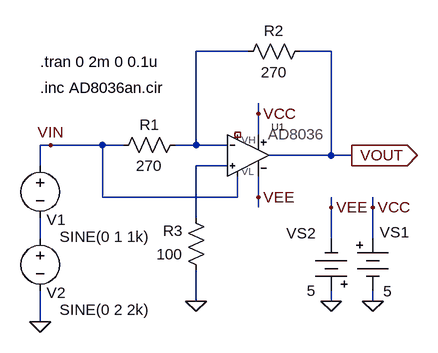
[diagram p0: schematic fig-01-03-15.asc]
fig-01-03-15.asc, the LTspice schematic file:
Version 4
SHEET 1 880 680
WIRE 192 16 112 16
WIRE 320 16 272 16
WIRE 208 112 208 96
WIRE 208 144 208 112
WIRE -112 160 -128 160
WIRE -32 160 -112 160
WIRE 0 160 -32 160
WIRE 112 160 112 16
WIRE 112 160 80 160
WIRE 160 160 112 160
WIRE 320 176 320 16
WIRE 320 176 224 176
WIRE 352 176 320 176
WIRE -128 192 -128 160
WIRE 160 192 112 192
WIRE -32 240 -32 160
WIRE 176 240 176 208
WIRE 176 240 -32 240
WIRE 208 240 208 208
WIRE 208 256 208 240
WIRE 320 256 320 240
WIRE 384 256 384 240
WIRE 112 272 112 192
WIRE -128 304 -128 272
WIRE 320 304 320 256
WIRE 384 304 384 256
WIRE 112 400 112 352
WIRE 320 400 320 384
WIRE 384 400 384 384
WIRE -128 432 -128 384
FLAG -128 432 0
FLAG 352 176 VOUT
IOPIN 352 176 Out
FLAG -112 160 VIN
FLAG 320 400 0
FLAG 384 400 0
FLAG 320 256 VEE
FLAG 384 256 VCC
FLAG 208 112 VCC
FLAG 208 240 VEE
FLAG 112 400 0
SYMBOL voltage -128 176 R0
WINDOW 0 10 99 Left 2
WINDOW 3 30 125 Left 2
WINDOW 123 0 0 Left 0
WINDOW 39 0 0 Left 0
SYMATTR InstName V1
SYMATTR Value SINE(0 1 1k)
SYMBOL Misc\\battery 384 288 R0
WINDOW 0 11 6 Left 2
WINDOW 3 16 97 Left 2
WINDOW 123 0 0 Left 0
WINDOW 39 0 0 Left 0
SYMATTR InstName VS1
SYMATTR Value 5
SYMBOL Misc\\battery 320 400 R180
WINDOW 0 24 104 Left 2
WINDOW 3 24 16 Left 2
WINDOW 123 0 0 Left 0
WINDOW 39 0 0 Left 0
SYMATTR InstName VS2
SYMATTR Value 5
SYMBOL res 96 144 R90
WINDOW 0 0 56 VBottom 2
WINDOW 3 32 56 VTop 2
SYMATTR InstName R1
SYMATTR Value 270
SYMBOL res 288 0 R90
WINDOW 0 0 56 VBottom 2
WINDOW 3 32 56 VTop 2
SYMATTR InstName R2
SYMATTR Value 270
SYMBOL res 128 368 R180
WINDOW 0 36 76 Left 2
WINDOW 3 36 40 Left 2
SYMATTR InstName R3
SYMATTR Value 100
SYMBOL voltage -128 288 R0
WINDOW 0 10 99 Left 2
WINDOW 3 30 125 Left 2
WINDOW 123 0 0 Left 0
WINDOW 39 0 0 Left 0
SYMATTR InstName V2
SYMATTR Value SINE(0 2 2k)
SYMBOL AD8036 192 112 R0
SYMATTR InstName U1
TEXT -128 32 Left 2 !.tran 0 2m 0 0.1u
TEXT -128 72 Left 2 !.inc AD8036an.cir

The netlist it stands for:
* fig-01-03-15.asc
V1 VIN N003 SINE(0 1 1k)
VS1 VCC 0 5
VS2 0 VEE 5
R1 N001 VIN 270
R2 VOUT N001 270
R3 0 N002 100
V2 N003 0 SINE(0 2 2k)
XU1 N002 N001 NC_01 VIN VCC VEE VOUT AD8036an  ; pins In+ In- VH VL V+ V- OUT
.tran 0 2m 0 0.1u
.inc AD8036an.cir
.backanno
.end